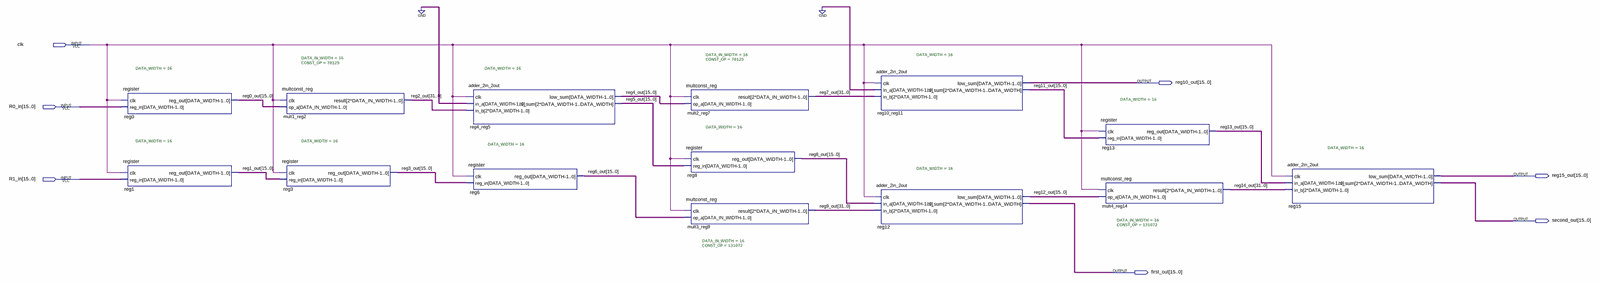
[diagram p0: schematic sheet, whole]
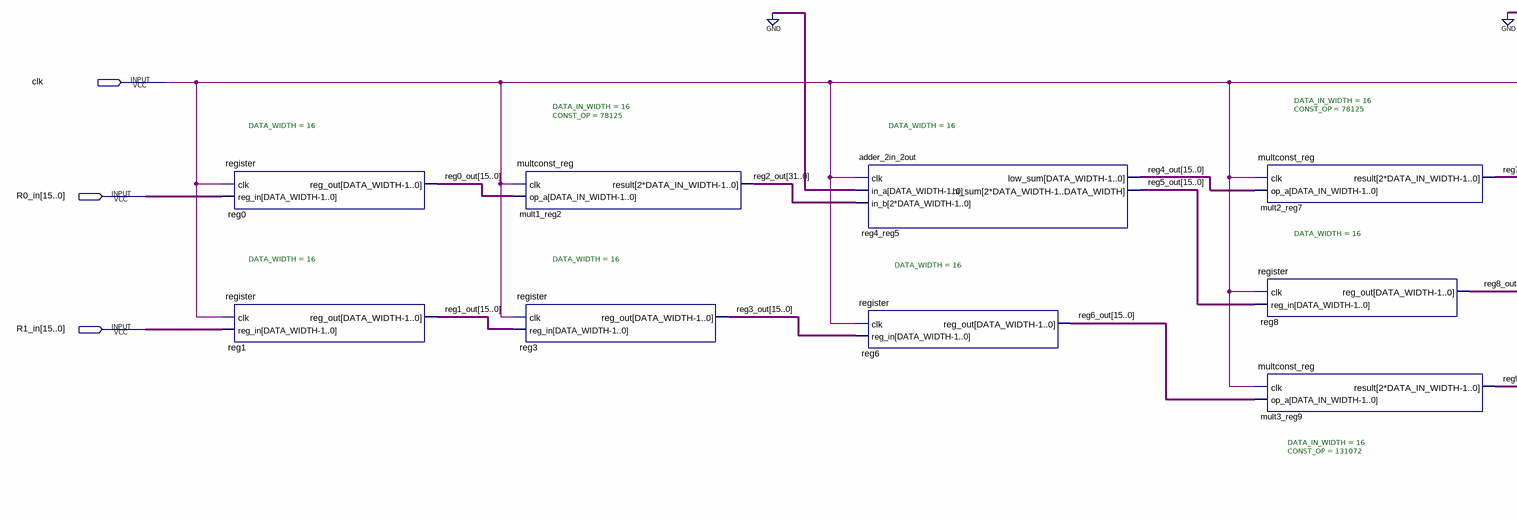
[diagram p1: schematic sheet, left part]
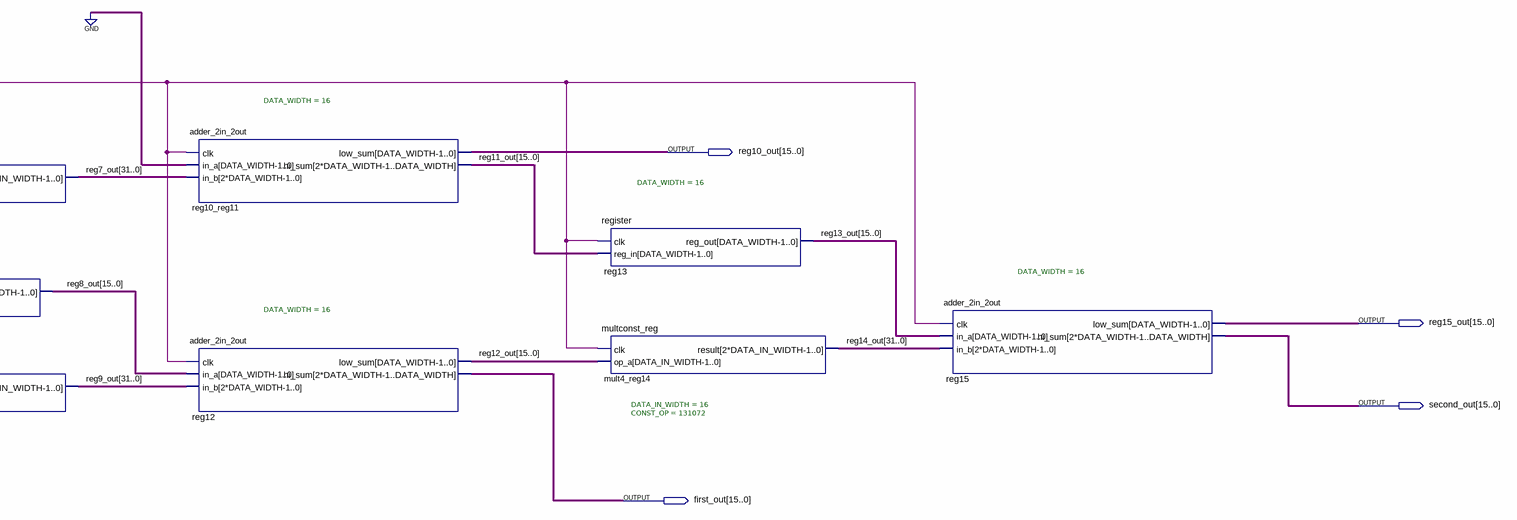
[diagram p2: schematic sheet, right part]
// Quartus schematic FFracConv.bdf as structural Verilog: 14 symbols, 7 pins
module FFracConv (
  input  clk,
  input  [15:0] R0_in,
  input  [15:0] R1_in,
  output [15:0] reg10_out,
  output [15:0] reg15_out,
  output [15:0] second_out,
  output [15:0] first_out
);

  wire [15:0] reg0_out, reg1_out, reg3_out, reg4_out, reg5_out, reg6_out, reg8_out, reg11_out, reg12_out,
       reg13_out;
  wire [31:0] reg2_out, reg7_out, reg9_out, reg14_out;

  register #(.DATA_WIDTH(16)) reg0 (.clk(clk), .reg_in(R0_in), .reg_out(reg0_out));
  register #(.DATA_WIDTH(16)) reg1 (.clk(clk), .reg_in(R1_in), .reg_out(reg1_out));
  multconst_reg #(.DATA_IN_WIDTH(16), .CONST_OP(78125)) mult1_reg2 (.clk(clk), .op_a(reg0_out), .result(reg2_out));
  register #(.DATA_WIDTH(16)) reg3 (.clk(clk), .reg_in(reg1_out), .reg_out(reg3_out));
  adder_2in_2out #(.DATA_WIDTH(16)) reg4_reg5 (
    .clk(clk), .in_a({16{1'b0}}), .in_b(reg2_out), .low_sum(reg4_out), .hi_sum(reg5_out));
  register #(.DATA_WIDTH(16)) reg6 (.clk(clk), .reg_in(reg3_out), .reg_out(reg6_out));
  multconst_reg #(.DATA_IN_WIDTH(16), .CONST_OP(78125)) mult2_reg7 (.clk(clk), .op_a(reg4_out), .result(reg7_out));
  register #(.DATA_WIDTH(16)) reg8 (.clk(clk), .reg_in(reg5_out), .reg_out(reg8_out));
  multconst_reg #(.DATA_IN_WIDTH(16), .CONST_OP(131072)) mult3_reg9 (.clk(clk), .op_a(reg6_out), .result(reg9_out));
  adder_2in_2out #(.DATA_WIDTH(16)) reg10_reg11 (
    .clk(clk), .in_a({16{1'b0}}), .in_b(reg7_out), .low_sum(reg10_out), .hi_sum(reg11_out));
  adder_2in_2out #(.DATA_WIDTH(16)) reg12 (
    .clk(clk), .in_a(reg8_out), .in_b(reg9_out), .low_sum(reg12_out), .hi_sum(first_out));
  register #(.DATA_WIDTH(16)) reg13 (.clk(clk), .reg_in(reg11_out), .reg_out(reg13_out));
  multconst_reg #(.DATA_IN_WIDTH(16), .CONST_OP(131072)) mult4_reg14 (.clk(clk), .op_a(reg12_out), .result(reg14_out));
  adder_2in_2out #(.DATA_WIDTH(16)) reg15 (
    .clk(clk), .in_a(reg13_out), .in_b(reg14_out), .low_sum(reg15_out), .hi_sum(second_out));
endmodule
